# Altium schematic sheet Isolated_Gate_DCDC.SchDoc
size A3
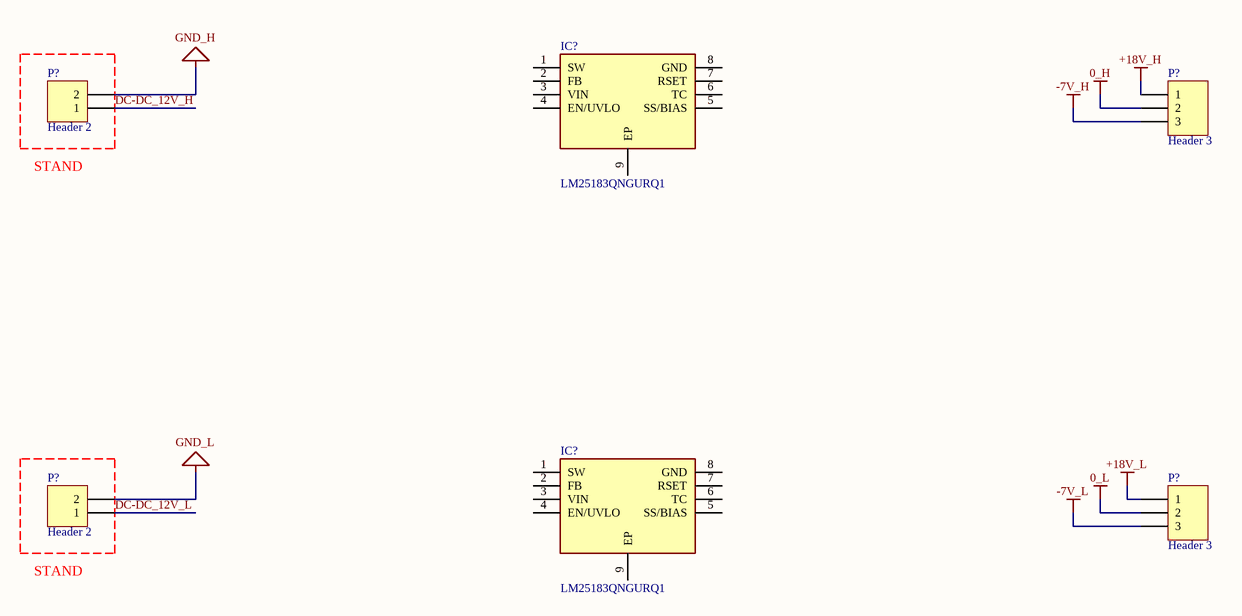
[diagram p0: Isolated_Gate_DCDC.SchDoc]

## Parts
(Parts that share a designator on the sheet are numbered #1, #2 ... from top to bottom, then left to right.)
IC?#1  LM25183QNGURQ1  [SON80P400X400X80-9N]
IC?#2  LM25183QNGURQ1  [SON80P400X400X80-9N]
P?#1  Header 3  [HDR1X3]
P?#2  Header 2  [HDR1X2]
P?#3  Header 3  [HDR1X3]
P?#4  Header 2  [HDR1X2]

## Nets
0_H: P?#1.2
0_L: P?#3.2
+18V_H: P?#1.1
+18V_L: P?#3.1
-7V_H: P?#1.3
-7V_L: P?#3.3
GND_H: P?#2.2
GND_L: P?#4.2
DC-DC_12V_H: P?#2.1
DC-DC_12V_L: P?#4.1

Not connected (* = marked no-connect by the designer): IC?#1 1(SW) 2(FB) 3(VIN) 4(EN/UVLO) 5(SS/BIAS) 6(TC) 7(RSET) 8(GND) 9(EP); IC?#2 1(SW) 2(FB) 3(VIN) 4(EN/UVLO) 5(SS/BIAS) 6(TC) 7(RSET) 8(GND) 9(EP)

## Notes on the sheet
- STAND

## Library data of the parts
IC?#1 IC?#2 = LM25183QNGURQ1: Integrated Circuit; Manufacturer_Name: Texas Instruments; Datasheet Link: https://www.ti.com/lit/ds/symlink/lm25183-q1.pdf?ts=1601923557129&ref_url=https%253A%252F%252Fwww.ti.com%252Fstore%252Fti%252Fen%252Fp%252Fproduct%252F%253Fp%253DLM25183QNGURQ1%2526keyMatch%253DLM25183QNGURQ1%2526tisearch%253DSearch-EN-everything%2526usec; Height: 0.8mm; Manufacturer_Part_Number: LM25183QNGURQ1
P?#1 P?#3 = Header 3: Header, 3-Pin; LatestRevisionDate: 17-Jul-2002; LatestRevisionNote: Re-released for DXP Platform.; Publisher: Altium Limited
P?#2 P?#4 = Header 2: Header, 2-Pin; LatestRevisionDate: 17-Jul-2002; LatestRevisionNote: Re-released for DXP Platform.; Publisher: Altium Limited